# Altium schematic sheet PowerSupply.SchDoc: PowerSupply
size A4; CheckedBy: D. Actis Grosso; Author: Simone C.; DocumentNumber: 2; Revision: 1.3; SheetNumber: 2; SheetTotal: 3
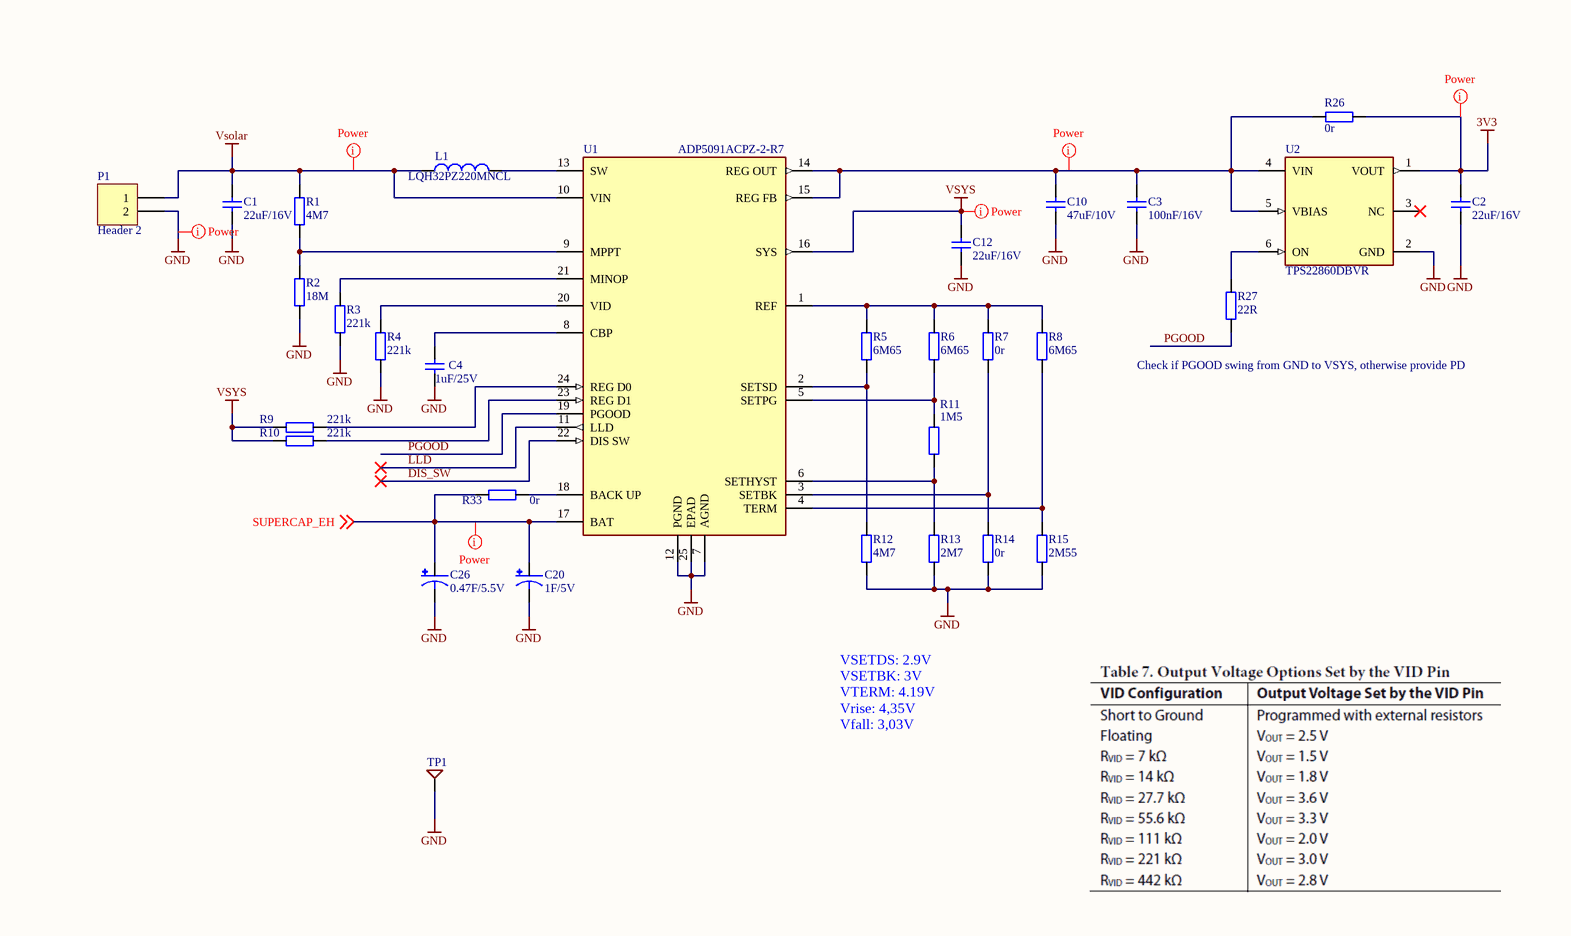
[diagram p0: PowerSupply.SchDoc, right]

## Parts
C1  value 22uF/16V  [C0805]  (hidden comment: Cap_0805_22uF/16V)
C2  value 22uF/16V  [C0805]  (hidden comment: Cap_0805_22uF/16V)
C3  value 100nF/16V  [C0402]  (hidden comment: Cap_0402_100n/16V)
C4  value 1uF/25V  [C0402]  (hidden comment: Cap_0402_1uF/25V)
C10  value 47uF/10V  [C1206]  (hidden comment: Cap_1206_47uF/10V)
C12  value 22uF/16V  [C0805]  (hidden comment: Cap_0805_22uF/16V)
C20  value 1F/5V  [DGH105Q5R5]  (hidden comment: SuperCap_1F/5V)
C26  value 0.47F/5.5V  [SUPCAP_D20mm]  (hidden comment: SuperCap_0.47F/5.5V)
L1  Part Number: LQH32PZ220MNCL  [FP-LQH32PB_NC-MFG]  (hidden comment: Inductor_22uH_550mA)
P1  Header 2  [HDR1X2]  (no BOM)
R1  value 4M7  [R0402]  (hidden comment: R_R0402_4M7)
R2  value 18M  [R0402]  (hidden comment: R_R0402_18M)
R3  value 221k  [R0402]  (hidden comment: R_R0402_221k)
R4  value 221k  [R0402]  (hidden comment: R_R0402_221k)
R5  value 6M65  [R0402]  (hidden comment: R_R0402_6M65)
R6  value 6M65  [R0402]  (hidden comment: R_R0402_6M65)
R7  value 0r  [R0402]  (hidden comment: R_R0402_0R)
R8  value 6M65  [R0402]  (hidden comment: R_R0402_6M65)
R9  value 221k  [R0402]  (hidden comment: R_R0402_221k)
R10  value 221k  [R0402]  (hidden comment: R_R0402_221k)
R11  value 1M5  [R0402]  (hidden comment: R_R0402_1M5)
R12  value 4M7  [R0402]  (hidden comment: R_R0402_4M7)
R13  value 2M7  [R0402]  (hidden comment: R_R0402_2M7)
R14  value 0r  [R0402]  (hidden comment: R_R0402_0R)
R15  value 2M55  [R0402]  (hidden comment: R_R0402_2M55)
R26  value 0r  [R0402]  (hidden comment: R_R0402_0R)
R27  value 22R  [R0402]  (hidden comment: R_R0402_22R)
R33  value 0r  [R0402]  (hidden comment: R_R0402_0R)
TP1  TestPoint Trough Hole  [TestP-TH-1.32mm]  (value not drawn)  (no BOM)
U1  ADP5091ACPZ-2-R7  [FP-CP-24-14-IPC_B]
U2  TPS22860DBVR  [SOT-23-6]

## Nets
3V3: C2.1 R26.1 U2.1(VOUT)
GND: C1.2 C2.2 C3.2 C4.2 C10.2 C12.2 C20.- C26.- P1.2 R2.1 R3.1 R4.1 R12.1 R13.1 R14.1 R15.1 TP1.0(TP) U1.7(AGND) U1.12(PGND) U1.25(EPAD) U2.2(GND)
Vsolar: C1.1 L1.1 P1.1 R1.2 U1.10(VIN)
VSYS: C12.1 R9.2 R10.2 U1.16(SYS)
DIS_SW: U1.22(DIS_SW)
LLD: U1.11(LLD)
PGOOD: R27.2 U1.19(PGOOD)
SUPERCAP_EH: C20.+ C26.+ R33.2 U1.17(BAT) ; off-sheet SUPERCAP_EH
NetC3_1: C3.1 C10.1 R26.2 U1.14(REG_OUT) U1.15(REG_FB) U2.4(VIN) U2.5(VBIAS)
NetC4_1: C4.1 U1.8(CBP)
NetL1_2: L1.2 U1.13(SW)
NetR1_1: R1.1 R2.2 U1.9(MPPT)
NetR3_2: R3.2 U1.21(MINOP)
NetR4_2: R4.2 U1.20(VID)
NetR5_1: R5.1 R12.2 U1.2(SETSD)
NetR5_2: R5.2 R6.2 R7.2 R8.2 U1.1(REF)
NetR6_1: R6.1 R11.2 U1.5(SETPG)
NetR7_1: R7.1 R14.2 U1.3(SETBK)
NetR8_1: R8.1 R15.2 U1.4(TERM)
NetR9_1: R9.1 U1.24(REG_D0)
NetR10_1: R10.1 U1.23(REG_D1)
NetR11_1: R11.1 R13.2 U1.6(SETHYST)
NetR27_1: R27.1 U2.6(ON)
NetR33_1: R33.1 U1.18(BACK_UP)

Not connected (* = marked no-connect by the designer): U2 3(NC)*

## Layout directives
net class Power: 3V3, GND, NetC3_1, SUPERCAP_EH, Vsolar, VSYS

## Notes on the sheet
- (near R27) Check if PGOOD swing from GND to VSYS, otherwise provide PD
- VSETDS: 2.9V
  VSETBK: 3V
  VTERM: 4.19V
  Vrise: 4,35V
  Vfall: 3,03V
- Title
- Size:
- A4
- Revision:
- Author:
- CheckedBy:
- Date:
- Time:
- Sheet
- of
- ApprovedBy:

## Library data of the parts
C1 C2 C12 = Cap_0805_22uF/16V: 22uF ±20% 16V Ceramic Capacitor X5R 0805; PartNumber: CL21A226MOQNNNE; Manufacturer: Samsung Electro-Mechanics; Case/Package: 0805; LCSC: C98190; Voltage Rating: 16V; LCSC_Alt_1: C33546008; LCSC_Alt_2: C6119898
C3 = Cap_0402_100n/16V: 16V 100nF X7R ±10% 0402 Multilayer Ceramic Capacitors MLCC - SMD/SMT ROHS; PartNumber: CL05B104KO5NNNC; Manufacturer: Samsung Electro-Mechanics; Case/Package: 0402; LCSC: C1525; Voltage Rating: 16V; LCSC_Alt_1: C22435936; LCSC_Alt_2: C576716
C4 = Cap_0402_1uF/25V: 1uF ±10% 25V Ceramic Capacitor X5R 0402; PartNumber: CL05A105KA5NQNC; Manufacturer: Samsung Electro-Mechanics; Case/Package: 0402; LCSC: C52923; LCSC_Alt_1: C7393852; LCSC_Alt_2: C7472946; Voltage Rating: 25V
C10 = Cap_1206_47uF/10V: 47uF ±20% 10V Ceramic Capacitor X5R 1206; PartNumber: CL31A476MPHNNNE; Manufacturer: Samsung Electro-Mechanics; Case/Package: 1206; LCSC: C96123; Voltage Rating: 10V; LCSC_Alt_1: C7432787; LCSC_Alt_2: C6119971
C20 = SuperCap_1F/5V: DGH Series 5.5 v 1.0 F 17x17x8.5mm LS=12mm Radial Super Capacitor; Manufacturer: CDE Illinois Capacitor; Voltage: 5V; Case/Package: Radial; PartNumber: DGH105Q5R5
C26 = SuperCap_0.47F/5.5V: Super cap D=20mm H=8mm; Voltage: 5.5V
L1 = Inductor_22uH_550mA: 550mA 22uH ±20% 685mΩ 650mA 1210 Fixed Inductors RoHS; Manufacturer: Murata; Saturation Current: 650mA; Package: 1210; LCSC_Alt_1: C53224120; LCSC: C4153652; Value: 22uH; LCSC_Alt_2: C22463994
P1 = Header 2: Header, 2-Pin
R1 R12 = R_R0402_4M7: 4.7MΩ ±1% 62.5mW 0402 Thick Film Resistor; PartNumber: 0402WGF4704TCE; Manufacturer: UNI-ROYAL; LCSC: C474132; Case/Package: 0402; LCSC_Alt_1: C354978; LCSC_Alt_2: C49654986; Tolerance: 1%
R2 = R_R0402_18M: 0402, 1% ,63mW; PartNumber: 0402WGF1805TCE; Manufacturer: UNI-ROYAL; Tolerance: 1; LCSC: C423222; Case/Package: 0402
R3 R4 R9 R10 = R_R0402_221k: 221kΩ ±1% 62.5mW 0402 Thick Film Resistor; PartNumber: 0402WGF2213TCE; Manufacturer: UNI-ROYAL; LCSC: C26998; Case/Package: 0402; LCSC_Alt_1: C2998126; LCSC_Alt_2: C49653699; Tolerance: 1%
R5 R6 R8 = R_R0402_6M65: 6.65MΩ ±1% 62.5mW 0402 Thick Film Resistor; PartNumber: 0402WGF6654TCE; Manufacturer: UNI-ROYAL; LCSC: C620472; Case/Package: 0402; LCSC_Alt_1: C172116; LCSC_Alt_2: C477773; Tolerance: 1%
R7 R14 R26 R33 = R_R0402_0R: 0Ω 62.5mW 50V Thick Film Resistor ±5% 0402 Chip Resistor - Surface Mount ROHS; PartNumber: 0402WGJ0000TCE; Manufacturer: UNI-ROYAL; LCSC: C21376; Case/Package: 0402; LCSC_Alt_1: C106231; LCSC_Alt_2: C2906877; Tolerance: 5%
R11 = R_R0402_1M5: 1.5MΩ ±1% 62.5mW 0402 Thick Film Resistor; PartNumber: 0402WGF1504TCE; Manufacturer: UNI-ROYAL; LCSC: C22276; Case/Package: 0402; LCSC_Alt_1: C49653927; LCSC_Alt_2: C2930014; Tolerance: 1%
R13 = R_R0402_2M7: 2.7MΩ ±1% 62.5mW 0402 Thick Film Resistor; PartNumber: 0402WGF2704TCE; Manufacturer: UNI-ROYAL; LCSC: C270621; Case/Package: 0402; LCSC_Alt_1: C3013160; LCSC_Alt_2: C49653355; Tolerance: 1%
R15 = R_R0402_2M55: 2.55MΩ ±1% 62.5mW 0402 Thick Film Resistor; PartNumber: 0402WGF2554TCE; Manufacturer: UNI-ROYAL; LCSC: C423206; Case/Package: 0402; LCSC_Alt_1: C477654; LCSC_Alt_2: 2612093; Tolerance: 1%
R27 = R_R0402_22R: 22Ω ±1% 62.5mW 0402 Thick Film Resistor; PartNumber: 0402WGF220JTCE; Manufacturer: UNI-ROYAL; LCSC: C25092; Case/Package: 0402; LCSC_Alt_1: C49654869; LCSC_Alt_2: C2929994; Tolerance: 1%
TP1 = TestPoint-TH: PartNumber: RS-200-208
U1 = ADP5091ACPZ-2-R7: -40℃~+125℃ 100mV~3.3V 1A 2V 360nA Charging IC、Protection IC Not supported Supercapacitor、Lithium Battery LFCSP-24(4x4) Battery Management ROHS; Manufacturer: Analog Devices; PartNumber: ADP5091ACPZ-2-R7; Case/Package: LFCSP-24(4x4); LCSC: C579259
U2 = TPS22860DBVR: Ultra-Low Leakage Current Single-Channel Load Switch; Manufacturer: Texas Instruments; PartNumber: TPS22860DBVR; LCSC: C132005; Package: SOT-23-6